# EAGLE design Adafruit PiCowbell Camera Breakout (EAGLE 9.6.2)
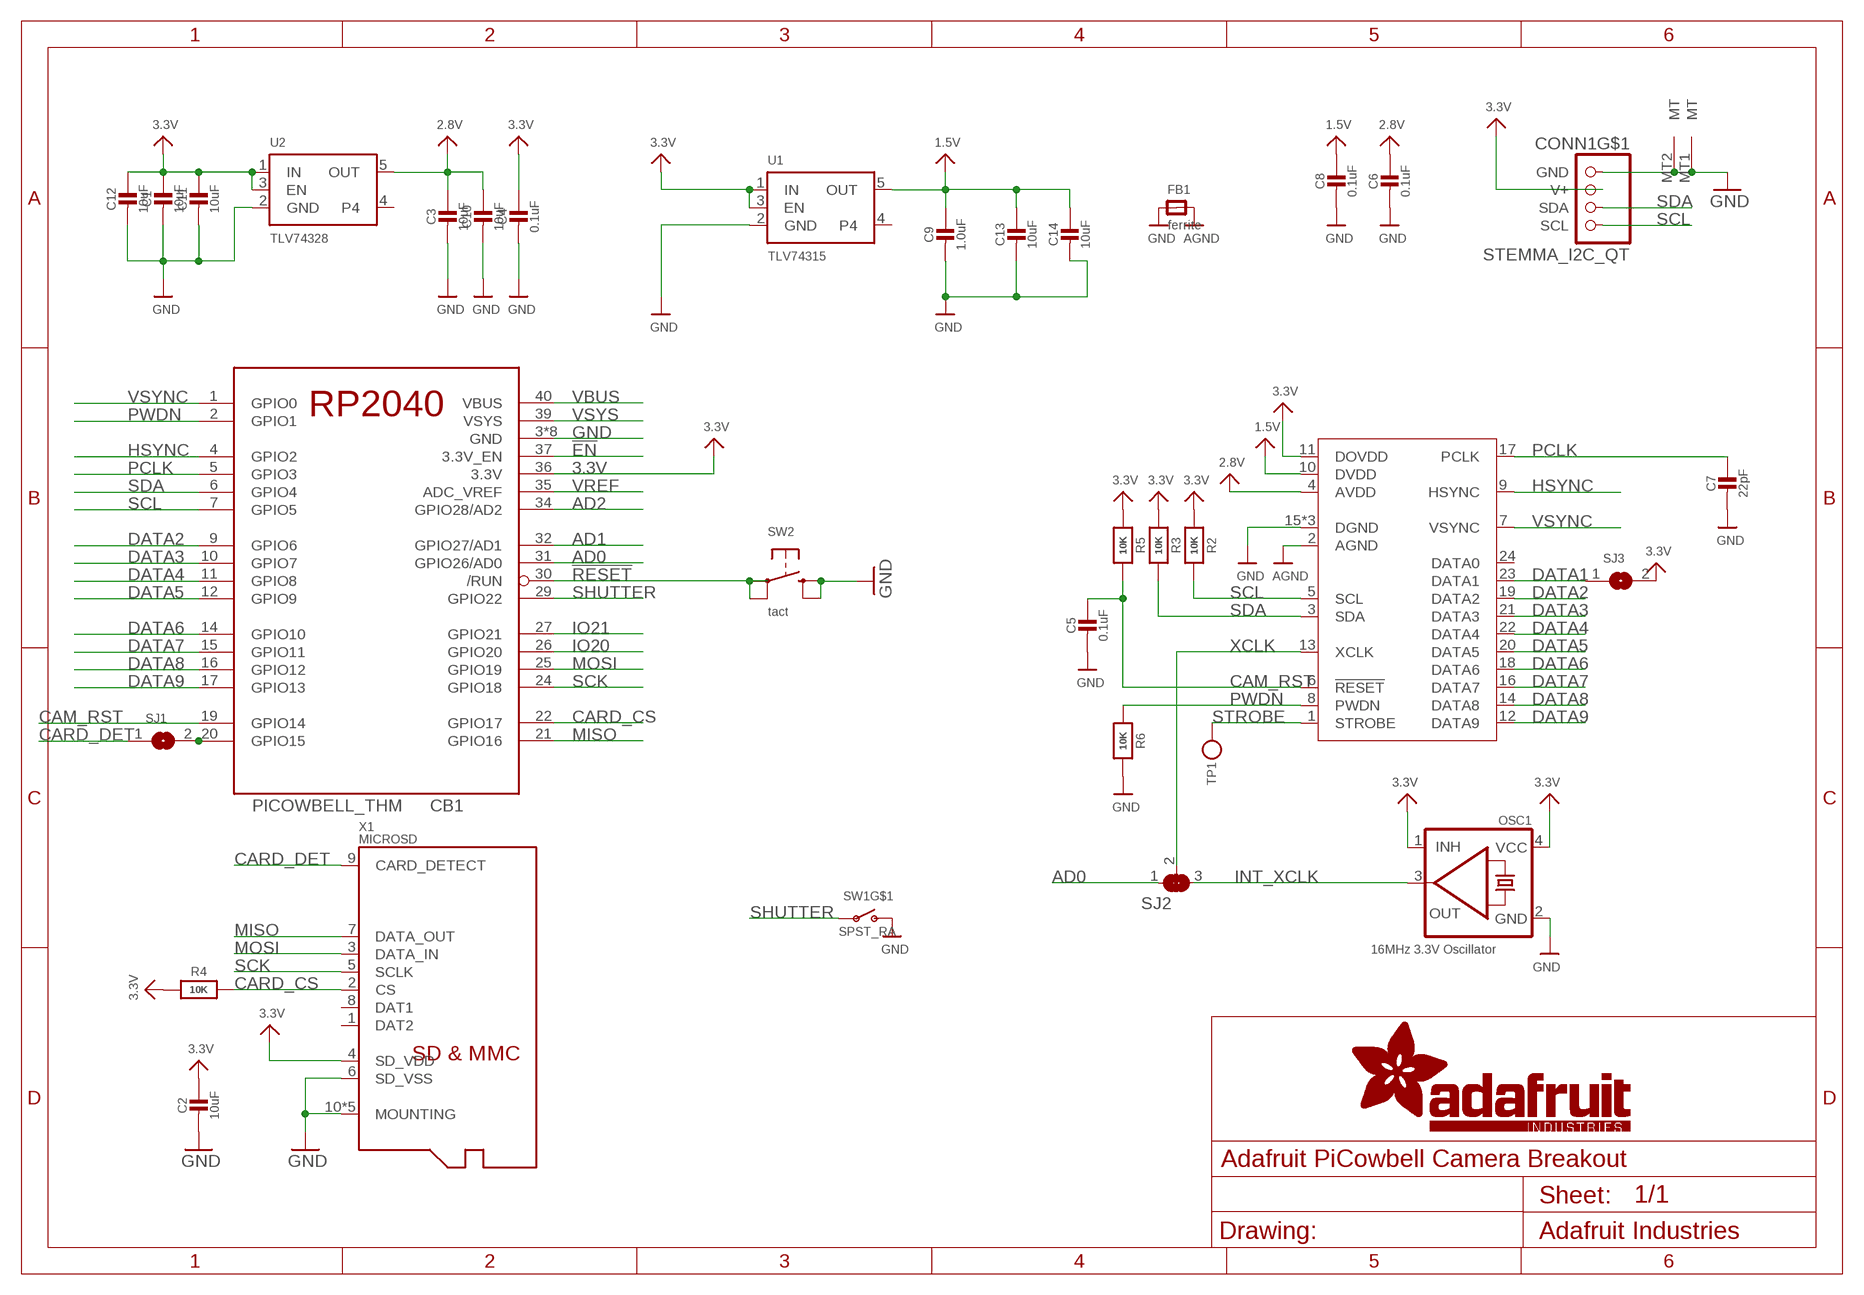
[diagram p0: schematic, sheet 1]

## Parts
C1  10uF  CAP_CERAMIC0805-NOOUTLINE  [0805-NO]
C2  10uF  CAP_CERAMIC0805-NOOUTLINE  [0805-NO]
C3  10uF  CAP_CERAMIC0805-NOOUTLINE  [0805-NO]
C4  0.1uF  CAP_CERAMIC_0402NO  [_0402NO]
C5  0.1uF  CAP_CERAMIC_0402NO  [_0402NO]
C6  0.1uF  CAP_CERAMIC_0402NO  [_0402NO]
C7  22pF  CAP_CERAMIC_0402NO  [_0402NO]
C8  0.1uF  CAP_CERAMIC_0402NO  [_0402NO]
C9  1.0uF  CAP_CERAMIC0603_NO  [0603-NO]
C10  10uF  CAP_CERAMIC0805-NOOUTLINE  [0805-NO]
C11  10uF  CAP_CERAMIC0805-NOOUTLINE  [0805-NO]
C12  10uF  CAP_CERAMIC0805-NOOUTLINE  [0805-NO]
C13  10uF  CAP_CERAMIC0805-NOOUTLINE  [0805-NO]
C14  10uF  CAP_CERAMIC0805-NOOUTLINE  [0805-NO]
CB1  PICOWBELL_THM  [PICOWBELL_THM]
CONN1  STEMMA_I2C_QT  [JST_SH4]
FB1  ferrite  FERRITE-0603NO  [0603-NO]
OSC1  16MHz 3.3V Oscillator  OSCILLATOR3.2X2.5  [OSC_3.2X2.5MM]
R2  10K  RESISTOR_0402NO  [_0402NO]
R3  10K  RESISTOR_0402NO  [_0402NO]
R4  10K  RESISTOR_0402NO  [_0402NO]
R5  10K  RESISTOR_0402NO  [_0402NO]
R6  10K  RESISTOR_0402NO  [_0402NO]
SJ1  SOLDERJUMPER  [SOLDERJUMPER_ARROW_NOPASTE]
SJ2  SOLDERJUMPER_2WAY  [SOLDERJUMPER_2WAY_OPEN_NOPASTE]
SJ3  SOLDERJUMPERCLOSED  [SOLDERJUMPER_CLOSEDWIRE]
SW1  SPST_RA  SWITCH_SPST_MNT_2*4*3.5  [SPST_TACTILE_RA_2*4*3.5MM]
SW2  tact  SWITCH_TACT_SMT_RKB2  [BTN_RKB2_4.6X2.8]
TP1  TESTPOINTROUND1.5MM  [TESTPOINT_ROUND_1.5MM]
U1  TLV74315  VREG_SOT23-5  [SOT23-5]
U2  TLV74328  VREG_SOT23-5  [SOT23-5]
X1  MICROSD  MICROSD104031-0811  [MOLEX_104031-0811]
X2  CAMERA_OV2640_SLIM  [OV2640FSL_SLIM]

## Nets
1.5V: C8.1 C9.1 C13.1 C14.1 U1.5(OUT) X2.10(DVDD)
2.8V: C3.1 C6.1 C10.1 U2.5(OUT) X2.4(AVDD)
3.3V: C1.1 C2.1 C4.1 C11.1 C12.1 CB1.36(3.3V) CONN1.2(V+) OSC1.1(INH) OSC1.4(VCC) R2.1 R3.1 R4.1 R5.1 SJ3.2 U1.1(IN) U1.3(EN) U2.1(IN) U2.3(EN) X1.4(SD_VDD) X2.11(DOVDD)
!EN: CB1.37(3.3V_EN)
!RESET: CB1.30(/RUN) SW2.A'(P1) SW2.A(P)
AD0: CB1.31(GPIO26/AD0) SJ2.1
AD1: CB1.32(GPIO27/AD1)
AD2: CB1.34(GPIO28/AD2)
AGND: FB1.2 X2.2(AGND)
CAM_RST: C5.1 CB1.19(GPIO14) R5.2 X2.6(!RESET)
CARD_CS: CB1.22(GPIO17) R4.2 X1.2(CS)
CARD_DET: SJ1.1 X1.9(CARD_DETECT)
DATA1: SJ3.1 X2.23(DATA1)
DATA2: CB1.9(GPIO6) X2.19(DATA2)
DATA3: CB1.10(GPIO7) X2.21(DATA3)
DATA4: CB1.11(GPIO8) X2.22(DATA4)
DATA5: CB1.12(GPIO9) X2.20(DATA5)
DATA6: CB1.14(GPIO10) X2.18(DATA6)
DATA7: CB1.15(GPIO11) X2.16(DATA7)
DATA8: CB1.16(GPIO12) X2.14(DATA8)
DATA9: CB1.17(GPIO13) X2.12(DATA9)
GND: C1.2 C2.2 C3.2 C4.2 C5.2 C6.2 C7.2 C8.2 C9.2 C10.2 C11.2 C12.2 C13.2 C14.2 CB1.3(GND) CB1.8(GND) CB1.13(GND) CB1.18(GND) CB1.23(GND) CB1.28(GND) CB1.33(GND) CB1.38(GND) CONN1.1(GND) CONN1.MT1(MT) CONN1.MT2(MT) FB1.1 OSC1.2(GND) R6.2 SW1.2(S) SW2.B'(S1) SW2.B(S) U1.2(GND) U2.2(GND) X1.6(SD_VSS) X1.10(MOUNTING) X1.G1(MOUNTING) X1.G2(MOUNTING) X1.G3(MOUNTING) X1.G4(MOUNTING) X2.15(DGND) X2.SPRT1(DGND) X2.SPRT2(DGND)
HSYNC: CB1.4(GPIO2) X2.9(HSYNC)
INT_XCLK: OSC1.3(OUT) SJ2.3
IO20: CB1.26(GPIO20)
IO21: CB1.27(GPIO21)
MISO: CB1.21(GPIO16) X1.7(DATA_OUT)
MOSI: CB1.25(GPIO19) X1.3(DATA_IN)
N$1: CB1.20(GPIO15) SJ1.2
PCLK: C7.1 CB1.5(GPIO3) X2.17(PCLK)
PWDN: CB1.2(GPIO1) R6.1 X2.8(PWDN)
SCK: CB1.24(GPIO18) X1.5(SCLK)
SCL: CB1.7(GPIO5) CONN1.4(SCL) R2.2 X2.5(SCL)
SDA: CB1.6(GPIO4) CONN1.3(SDA) R3.2 X2.3(SDA)
SHUTTER: CB1.29(GPIO22) SW1.1(P)
STROBE: TP1.P$1 X2.1(STROBE)
VBUS: CB1.40(VBUS)
VREF: CB1.35(ADC_VREF)
VSYNC: CB1.1(GPIO0) X2.7(VSYNC)
VSYS: CB1.39(VSYS)
XCLK: SJ2.2 X2.13(XCLK)
Unconnected: SW1.MT1(MT) SW1.MT2(MT) U1.4 U2.4 X1.1(DAT2) X1.8(DAT1) X2.24(DATA0)

## Library data of the parts
C1-C14 = microbuilder:CAP_CERAMIC: Ceramic Capacitors For new designs, use the packages preceded by an '_' character since they are more reliable: The following footprints should be used on most boards: _0402 - Standard footprint for regular board layouts _0603 - Standard footprint for regular board layouts _0805 - Standard footprint for regular board layouts _1206 - Standard footprint for regular board layouts For extremely tight-pitch boards where space is at a premium, the following 'micro-pitch' footprints can be used (smaller pads, no silkscreen outline, etc.): _0402MP - Micro-pitch footprint for very dense/compact boards _0603MP - Micro-pitch footprint for very dense/compact boards _0805MP - Micro-pitch footprint for very dense/compact boards _1206MP - Micro-pitch footprint for very dense/compact boards
CB1 = adafruit_micro:PICOWBELL
CONN1 = adafruit_electromech:STEMMA_I2C; LCSC: C2845363
FB1 = microbuilder:FERRITE: Ferrite Bead 0603 MMZ1608B121C - 120 Ohm @ 100MHz, 600mA, 0.15 Ohm DC Resistance - Digikey: 445-2164-1-ND BK1608HW121-T - 120 Ohm, 600mA Ferrite Chip - Digikey: 587-1876-2-ND 0805 HZ0805B272R-10 - 2.7K Ohm @ 100MHz, 200mA, 0.8 Ohm DC Resistance - Digikey: 240-2504-1-ND (see also Murata BLM21BD272SN1L) MMZ2012Y152B - 1.5K Ohm @ 100MHz, 500mA, 0.4 Ohm DC Resistance - Digikey: 445-1560-1-ND - Mainly for high frequency (80-400MHz) MMZ2012R102A - 1K Ohm @ 100MHz, 500mA, 0.3 Ohm DC Resistance - Digikey: 445-1555-2-ND - More general purpose (10-200MHz)
OSC1 = microbuilder:OSCILLATOR: Oscillators 3.2x2.5mm SMT 4.0MHz +/- 50ppm, 3.3V, 9mA, -40/+85°C - Digikey: 535-9752-1-ND 50MHz +/- 50ppm, 3.3V, 8mA, -10/+70°C - Digikey: 478-4792-1-ND 5x7mm SMT 4.0MHz +/-20ppm 3.3V, 20mA, -20/+70°C - Digikey: 535-9329-2-ND 50MHz +/- 25ppm 3.3V, 35mA, -40/+85°C - Digikey: 631-1197-1-ND
R2-R6 = microbuilder:RESISTOR: Resistors For new designs, use the packages preceded by an '_' character since they are more reliable: The following footprints should be used on most boards: _0402 - Standard footprint for regular board layouts _0603 - Standard footprint for regular board layouts _0805 - Standard footprint for regular board layouts _1206 - Standard footprint for regular board layouts For extremely tight-pitch boards where space is at a premium, the following 'micro-pitch' footprints can be used (smaller pads, no silkscreen outline, etc.): _0402MP - Micro-pitch footprint for very dense/compact boards _0603MP - Micro-pitch footprint for very dense/compact boards _0805MP - Micro-pitch footprint for very dense/compact boards _1206MP - Micro-pitch footprint for very dense/compact boards
SJ1 = microbuilder:SOLDERJUMPER: SMD Solder JUMPER Solder the two pads together to create a connection, or remove the solder to break it. REFLOW - Use this footprint for solder paste and reflow ovens. WAVE - Use this footprint for hand-soldering (larger pads). CLOSED - Has a trace between the two pads to ensure it is closed by default. The trace needs to be cut to disable the jumper, and can be closed again by creating a solder bridge between the two pads.; BOM: EXCLUDE
SJ2 = microbuilder:SOLDERJUMPER_2WAY: 2-Way Solder Jumper
SJ3 = microbuilder:SOLDERJUMPER: SMD Solder JUMPER Solder the two pads together to create a connection, or remove the solder to break it. REFLOW - Use this footprint for solder paste and reflow ovens. WAVE - Use this footprint for hand-soldering (larger pads). CLOSED - Has a trace between the two pads to ensure it is closed by default. The trace needs to be cut to disable the jumper, and can be closed again by creating a solder bridge between the two pads.
SW1 = adafruit_electromech:SWITCH_SPST_MNT: Switch - SPST 4UCon 19192 (6.7x2.6mm SMT)
SW2 = adafruit_electromech:SWITCH_TACT_SMT: SMT Tact Switches RKB2 https://www.digikey.com/short/m027prz5
TP1 = microbuilder:TESTPOINT: Test Point Various test points for characterisation and PCB testing TESTPOINT_SMT - Compact Surface Mount Test Point [Digikey: 5016KTR-ND]
U1 U2 = adafruit_power:VREG_SOT23-5: SOT23-5 Fixed Voltage Regulators Part Current Out V Out V In V Dropout θJA (°C/W) TJ (°C) Digikey Part No. ADP121 150mA 3.3V 3.4-5.5V 0.09V @ 150mA -- -- ADP121-AUJZ33R7CT-ND ADP121 150mA 3.0V 3.1-5.5V 0.09V @ 150mA -- -- ADP121-AUJZ30R7CT-ND ADP122 300mA 3.3V 3.4-5.5V 0.085V @ 300mA -- -- ADP122AUJZ-3.3-R7CT-ND ADP1712 300mA 3.3V 3.5-5.5V 0.17V @ 300mA -- -- ADP1712AUJZ-3.3-R7TR-ND AP7311 (Low Cost) 150mA 3.3V 3.5-6V 0.15V @ 150mA -- -- AP7311-33WG-7DICT-ND LD39015M18R 150mA 1.8V 1.9V-5.5V 0.08V @ 100mA -- -- 497-6977-1-ND LP2985A-33DBVR 150mA 3.3V 3.3-16V 0.28V @ 150mA 206 150 296-18479-1-ND MCP1824T-3302E/OT 300mA 3.3V 3.5V-6V 0.2V @ 300mA -- -- MCP1824T-3302E/OTCT-ND MIC5205-2.5YM5 TR 150mA 2.5V 2.7-16V 0.165V @ 150mA -- -- 576-1257-2-ND MIC5205-3.0YM5 TR 150mA 3.0V 3.2V-16V 0.165V @ 150mA -- -- 576-1258-2-ND MIC5205-3.3YM5 TR 150mA 3.3V 3.5V-16V 0.165V @ 150mA -- -- 576-1259-2-ND TPS780330220 150mA 3.3V+2.2V 3.6-5.5V 250mV Max -- -- 296-23332-1-ND TDA3663/N1,135 100mA 3.3V 3.5-45V 0.18V @ 50mA -- -- 568-5343-1-ND Max operating temp can be calculated using θJA, TJ (max junction temperature), and power in watts. Set the "Maximum Ambient Temperature" until it reaches TJ ("Max Junction Temperature"), which is the absolute limit for safe use of the regulator: Heat Sink Temperature Calculator <http://www.daycounter.com/Calculators/Heat-Sink-Temperature-Calculator.phtml> For example, With 12V source into a 3.3V LP2985 and a 30mA load, we are dissipating (12V-3.3V) * 0.03A = 0.261W. With a θJA of 206 °C/W, a TJ of 150°C, and 261mW we can safely use the chip without a heat sink up to 75°C (=147.1°C Junction Temperature).; JLC_ROTATION: 0
X1 = adafruit_electromech:MICROSD: MicroSD/Transflash Card Holder with SPI pinout 3M: 2908-05WB-MG 4UConnector: 19656 Footprint courtesy: Adafruit Industries
X2 = adafruit_sensor:CAMERA_OV2640

## Net classes
1 highpower: width 0.305 mm, drill 0.483 mm
2 lowpower: width 0.254 mm, drill 0.483 mm

## Board
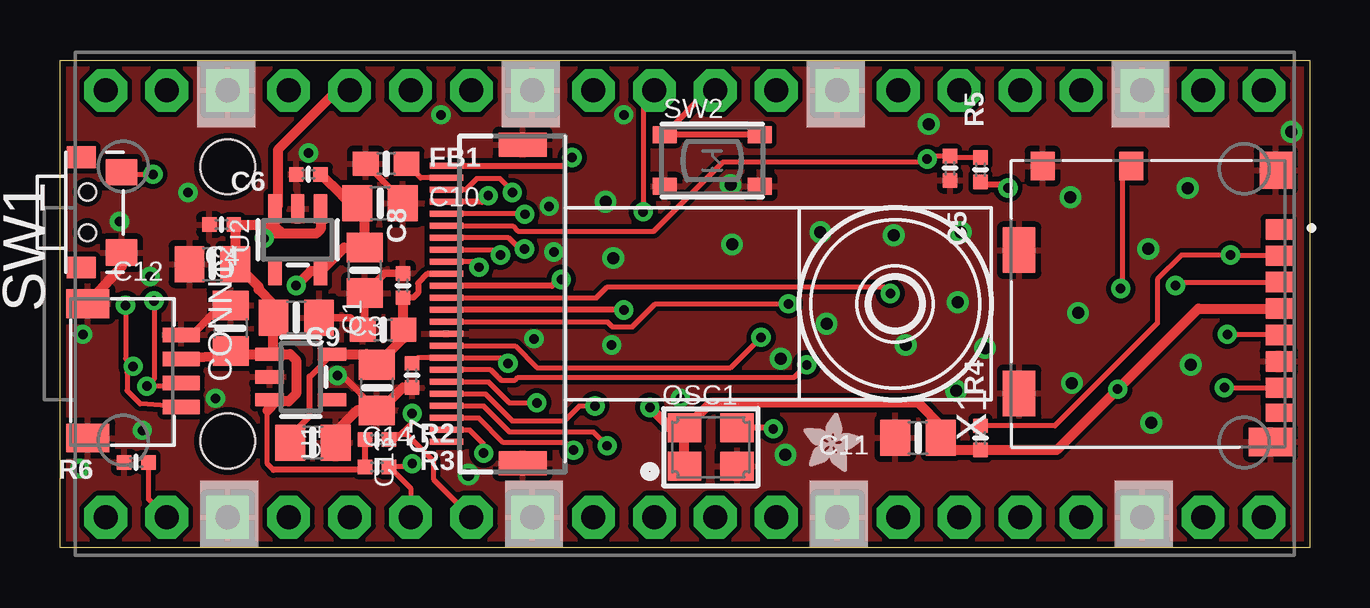
[diagram p1: board, top side]
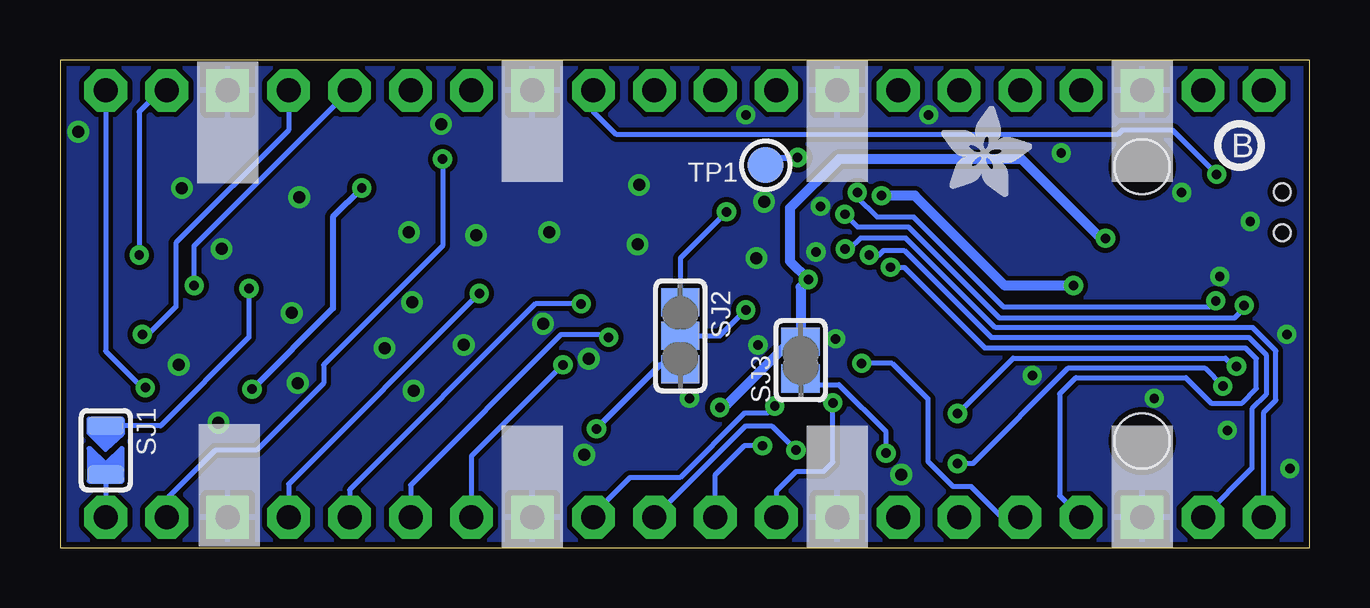
[diagram p2: board, bottom side, seen from below]

Size 52.07 x 20.32 mm. Coordinates in mm from the lower left corner, seen from the top.
Outline: 0,0 0,20.32 52.07,20.32 52.07,0 0,0
Copper layers (1*16): Top 0.035mm / dielectric 1.5mm / Bottom 0.035mm
Design rules "adafruit": minimum track width 8mil, minimum drill 15.5mil, track to track 8mil, track to pad 8mil, pad to pad 8mil, via to via 8mil, smd to smd 8mil, copper to edge 10mil, drill to drill 8mil, minimum pad ring 10mil, minimum via ring 8mil, stop-mask expansion 2mil, vias tented up to drill 20mil, thermal gap 10mil
Holes 2.29 mm at 6.99,15.88 6.99,4.45

### Footprints (pad centres in the part's own frame; a part is rotated, then mirrored left to right if it is on the bottom)
0805-NO = smd 1.24 x 1.5: 1 -0.95,0; 2 0.95,0
_0402NO = smd 0.6 x 0.6: 1 -0.508,0; 2 0.508,0
0603-NO = smd 1.075 x 1: 1 -0.85,0; 2 0.85,0
PICOWBELL_THM = drill 1 pad 1.778 octagon: 1 1.27,0; 2 3.81,0; 4 8.89,0; 5 11.43,0; 6 13.97,0; 7 16.51,0; 9 21.59,0; 10 24.13,0; 11 26.67,0; 12 29.21,0; 14 34.29,0; 15 36.83,0; 16 39.37,0; 17 41.91,0; 19 46.99,0; 20 49.53,0; 21 49.53,17.78; 22 46.99,17.78; 24 41.91,17.78; 25 39.37,17.78; 26 36.83,17.78; 27 34.29,17.78; 29 29.21,17.78; 30 26.67,17.78; 31 24.13,17.78; 32 21.59,17.78; 34 16.51,17.78; 35 13.97,17.78; 36 11.43,17.78; 37 8.89,17.78; 39 3.81,17.78; 40 1.27,17.78 | drill 1 pad 1.778 square: 3 6.35,0; 8 19.05,0; 13 31.75,0; 18 44.45,0; 23 44.45,17.78; 28 31.75,17.78; 33 19.05,17.78; 38 6.35,17.78
JST_SH4 = smd 0.6 x 1.55: 1 -1.5,2.006; 2 -0.5,2.006; 3 0.5,2.006; 4 1.5,2.006 | smd 1.2 x 1.8: MT1 -2.8,-1.894; MT2 2.8,-1.894
OSC_3.2X2.5MM = smd 1.4 x 1.2: 1 -1.1,-0.8; 2 1.1,-0.8; 3 1.1,0.8; 4 -1.1,0.8
SOLDERJUMPER_ARROW_NOPASTE = smd 0.762 x 1.524: 1 -1.016,0; 2 1.016,0
SOLDERJUMPER_2WAY_OPEN_NOPASTE = smd 1.168 x 1.6: 1 -1.397,0; 2 0,0; 3 1.397,0
SOLDERJUMPER_CLOSEDWIRE = smd 1.168 x 1.6: 1 -0.762,0; 2 0.762,0 | smd 0.635 x 0.203: WIRE 0,0
SPST_TACTILE_RA_2*4*3.5MM = smd 1.1 x 1.3: 1 -1.675,1.042; 2 1.675,1.042 | smd 0.9 x 1.2: MT1 -2.3,-0.635; MT2 2.3,-0.635 | hole 0.7: -0.85,-0.381; 0.85,-0.381
BTN_RKB2_4.6X2.8 = smd 1 x 0.7: A 1.973,1.075; A' -1.973,1.075; B 1.973,-1.075; B' -1.973,-1.075
TESTPOINT_ROUND_1.5MM = smd 1.5 x 1.5: P$1 0,0
SOT23-5 = smd 0.55 x 1.2: 1 -0.95,-1.3; 2 0,-1.3; 3 0.95,-1.3; 4 0.95,1.3; 5 -0.95,1.3
MOLEX_104031-0811 = smd 0.85 x 1.1: 1 3.105,-5.45; 2 2.005,-5.45; 3 0.905,-5.45; 4 -0.195,-5.45; 5 -1.295,-5.45; 6 -2.395,-5.45; 7 -3.495,-5.45 | smd 0.75 x 1.1: 8 -4.545,-5.45 | smd 1.2 x 1: 9 5.74,0.7; 10 5.74,4.4 | smd 1.55 x 1.35: G1 5.565,-5.325 | smd 1.17 x 1.8: G2 -5.755,-5.1 | smd 1.9 x 1.35: G3 -3.73,5.375; G4 2.24,5.375
OV2640FSL_SLIM = smd 0.25 x 1.4: 1 5.75,1.678; 2 5.25,1.678; 3 4.75,1.678; 4 4.25,1.678; 5 3.75,1.678; 6 3.25,1.678; 7 2.75,1.678; 8 2.25,1.678; 9 1.75,1.678; 10 1.25,1.678; 11 0.75,1.678; 12 0.25,1.678; 13 -0.25,1.678; 14 -0.75,1.678; 15 -1.25,1.678; 16 -1.75,1.678; 17 -2.25,1.678; 18 -2.75,1.678; 19 -3.25,1.678; 20 -3.75,1.678; 21 -4.25,1.678; 22 -4.75,1.678; 23 -5.25,1.678; 24 -5.75,1.678 | smd 1 x 2: SPRT1 -6.635,-1.5; SPRT2 6.635,-1.5

### Placement (x,y rotation side)
C1  9.84,9.59 0 top
C2  7.11,9.14 90 top
C3  12.7,11.56 270 top
C4  6.73,13.46 180 top
C5  37.08,15.81 270 top
C6  10.35,15.56 180 top
C7  14.67,7.18 270 top
C8  14.29,10.92 90 top
C9  13.46,9.08 180 top
C10  13.34,14.35 0 top
C11  35.75,4.57 180 top
C12  6.35,11.81 180 top
C13  13.21,6.67 270 top
C14  10.54,4.38 0 top
CB1  0.64,1.27 0 top
CONN1  3.05,7.37 270 top
FB1  13.59,16 0 top
OSC1  27.11,4.19 0 top
PLABEL54  [PLABEL54]  50.29,7.37 0 bottom
PLABEL55  [PLABEL55]  3.49,13.91 90 top
PLABEL56  [PLABEL56]  1.78,2.92 0 top
PLABEL57  [PLABEL57]  4.57,2.92 0 top
PLABEL58  [PLABEL58]  9.53,2.92 0 top
PLABEL59  [PLABEL59]  11.81,2.92 0 top
PLABEL60  [PLABEL60]  14.61,2.92 0 top
PLABEL61  [PLABEL61]  22.23,2.92 0 top
PLABEL62  [PLABEL62]  29.84,2.92 0 top
PLABEL63  [PLABEL63]  34.92,2.92 0 top
PLABEL64  [PLABEL64]  37.47,2.92 0 top
PLABEL65  [PLABEL65]  40.01,2.92 0 top
PLABEL66  [PLABEL66]  42.55,2.92 0 top
PLABEL67  [PLABEL67]  47.62,2.92 0 top
PLABEL68  [PLABEL68]  50.16,2.92 0 top
PLABEL69  [PLABEL69]  50.16,17.4 0 top
PLABEL70  [PLABEL70]  47.62,17.4 0 top
PLABEL71  [PLABEL71]  42.55,17.4 0 top
PLABEL72  [PLABEL72]  40.01,17.4 0 top
PLABEL73  [PLABEL73]  37.47,17.4 0 top
PLABEL74  [PLABEL74]  34.92,17.4 0 top
PLABEL75  [PLABEL75]  30.35,17.14 90 top
PLABEL76  [PLABEL76]  24,17.14 90 top
PLABEL77  [PLABEL77]  22.23,17.4 0 top
PLABEL78  [PLABEL78]  14.61,17.4 0 top
PLABEL79  [PLABEL79]  12.06,17.4 0 top
PLABEL80  [PLABEL80]  9.53,17.4 0 top
PLABEL81  [PLABEL81]  4.45,17.4 0 top
PLABEL82  [PLABEL82]  1.91,17.4 0 top
PLABEL83  [PLABEL83]  16.13,2.92 0 top
PLABEL84  [PLABEL84]  31.62,15.24 0 top
PLABEL85  [PLABEL85]  13.34,12.06 0 bottom
PLABEL86  [PLABEL86]  38.23,9.65 0 bottom
PLABEL88  [PLABEL88]  42.55,2.41 90 bottom
PLABEL89  [PLABEL89]  40.01,2.41 90 bottom
PLABEL90  [PLABEL90]  37.47,2.41 90 bottom
PLABEL91  [PLABEL91]  34.92,2.41 90 bottom
PLABEL92  [PLABEL92]  29.84,2.41 90 bottom
PLABEL93  [PLABEL93]  27.3,2.41 90 bottom
PLABEL94  [PLABEL94]  24.77,2.41 90 bottom
PLABEL95  [PLABEL95]  22.23,2.41 90 bottom
PLABEL96  [PLABEL96]  17.14,2.41 90 bottom
PLABEL97  [PLABEL97]  14.61,2.41 90 bottom
PLABEL98  [PLABEL98]  12.06,2.41 90 bottom
PLABEL99  [PLABEL99]  9.53,2.41 90 bottom
PLABEL100  [PLABEL100]  4.45,2.41 90 bottom
PLABEL101  [PLABEL101]  1.91,2.41 90 bottom
PLABEL102  [PLABEL102]  50.16,17.91 90 bottom
PLABEL103  [PLABEL103]  47.62,2.41 90 bottom
PLABEL104  [PLABEL104]  42.55,17.91 90 bottom
PLABEL107  [PLABEL107]  24.51,6.6 90 bottom
PLABEL108  [PLABEL108]  27.43,5.84 0 bottom
PLABEL109  [PLABEL109]  27.05,11.81 0 bottom
PLABEL110  [PLABEL110]  20.07,7.24 0 bottom
PLABEL111  [PLABEL111]  40.01,16.89 90 bottom
PLABEL112  [PLABEL112]  47.62,17.02 90 bottom
PLABEL113  [PLABEL113]  29.84,16.51 90 bottom
R2  13.21,4.51 0 top
R3  13.21,3.37 0 top
R4  38.35,4.57 90 top
R5  38.35,15.75 90 top
R6  3.17,3.56 180 top
SJ1  50.16,4.06 270 bottom
SJ2  26.23,8.83 270 bottom
SJ3  21.21,7.81 90 bottom
SW1  1.52,13.97 270 top
SW2  27.18,16.13 0 top
TP1  22.67,15.94 180 bottom
U1  10.03,7.11 270 top
U2  9.91,12.83 180 top
U$10  [ADAFRUIT_3.5MM]  15.37,14.61 0 bottom
U$11  [ADAFRUIT_2.5MM]  30.99,3.17 0 top
U$12  [PCBFEAT-REV-040]  2.92,16.76 0 bottom
X1  45.34,10.16 90 top
X2  17.78,10.16 90 top

### Tracks (layer width: path | path; a pad name or v marks a point on that pad's centre or on a via)
1.5V
  Top 0.254: X2.10 15.31,11.41 14.92,11.02 14.92,10.61 14.72,10.41 C8.1 | C14.1 9.59,4.66 10.4,5.47 10.4,7.13 U1.5
  Top 0.406: U1.5 12.76,8.06 C13.1 14.31,8.72 C9.1 14.31,10.39 C8.1
2.8V  (via drill 0.39)
  Top 0.254: v17.84,14.67 17.59,14.41 X2.4
  Top 0.406: v9.84,10.92 10.45,11.53 U2.5 11.84,12.51 C3.1 12.7,14.04 C10.1 12.38,14.29 12.14,14.29 11.3,15.13 11.28,15.13 C6.1
  Bottom 0.406: v9.84,10.92 12.7,10.92 16.45,14.67 v17.84,14.67
3.3V  (via drill 0.39)
  Top 0.203: 8.89,3.24 8.64,3.5 8.64,5.71 | C2.1 7.11,8.12 6.99,7.99
  Top 0.254: R2.1 R3.1 12.57,3.24 8.89,3.24 | v20.89,11.18 20.77,11.18 20.5,10.91 X2.11 | R5.1 38.48,15.11 39.37,15.11 v39.5,14.99
  Top 0.406: X1.4 47.43,9.96 v44.07,6.6 41.53,4.06 R4.1 37.21,4.06 C11.1 36.7,5.08 35.75,6.03 27.11,6.03 26.29,5.21 25.21,5.21 v24.57,5.84 25.43,4.99 OSC1.4 OSC1.1 | C2.1 7.45,8.06 U1.1 | U1.1 8.89,8.22 C1.1 8.89,10.14 8.28,10.76 8.28,10.88 7.34,11.81 C12.1 7.3,13.44 C4.1 8.68,13.46 8.96,13.74 U2.3 | U1.1 9.59,8.06 9.84,7.81 9.84,6.41 9.53,6.1 9.02,6.1 | 9.02,6.1 8.64,5.71 | 9.02,6.1 8.8,6.1 U1.3 | 6.99,7.99 CONN1.2 | U2.1 10.86,13.27 10.67,13.08 9.27,13.08 | 9.27,13.08 8.51,13.08 v8.51,12.89 | 9.27,13.08 8.96,13.4 U2.3 | U2.3 9.08,14.25 9.08,16.57 11.56,19.05 CB1.36
  Bottom 0.254: v39.5,14.99 40.7,13.78 40.7,9.97 v44.07,6.6
  Bottom 0.406: v8.51,12.89 8.7,12.89 12,16.19 19.61,16.19 21.65,14.14 21.65,11.94 v20.89,11.18 21.21,10.86 SJ3.2 21.65,8.57 24.38,5.84 v24.57,5.84
!RESET
  Top 0.254: SW2.A SW2.A' 26.99,19.05 CB1.30
AD0  (via drill 0.39)
  Top 0.203: CB1.31 24.3,18.58 v24.3,13.99
  Bottom 0.203: v24.3,13.99 26.23,12.06 SJ2.1
AGND
  Top 0.203: X2.2 15.03,15.41 FB1.2
CAM_RST  (via drill 0.39)
  Top 0.203: X2.6 18.85,13.41 19.08,13.19 24.75,13.19 27.62,16.07 36.01,16.07 v36.13,16.19 36.24,16.3 C5.1 37.15,16.26 R5.2
  Bottom 0.203: CB1.19 47.62,2.03 45.59,4.06 43.88,4.06 41.08,6.86 41.08,7.62 36.13,12.57 v36.13,16.19
CARD_CS  (via drill 0.39)
  Top 0.203: X1.2 50.76,12.19 v48.77,12.19 46.74,12.19 45.72,11.18 45.72,9.34 41.46,5.08 R4.2
  Bottom 0.203: CB1.22 47.88,19.05 48.77,18.16 v48.77,12.19
CARD_DET  (via drill 0.39)
  Top 0.203: X1.9 44.26,15.52 44.26,10.86 v44.2,10.79
  Bottom 0.203: v44.2,10.79 44.2,8.76 47.88,5.08 SJ1.1
DATA1  (via drill 0.39)
  Top 0.203: X2.23 17.06,4.91 17.65,4.32 v17.65,3.94
  Bottom 0.203: v17.65,3.94 17.65,4.83 19.62,6.79 20.95,6.79 SJ3.1
DATA2  (via drill 0.39)
  Top 0.203: X2.19 17.85,6.91 18.73,6.04 v19.87,6.04
  Bottom 0.203: CB1.9 22.23,2.35 21.4,3.17 20.26,3.17 19.87,3.56 v19.87,6.04
DATA3  (via drill 0.39)
  Top 0.203: X2.21 17.64,5.91 18.73,4.82 22.23,4.82 v22.8,4.25
  Bottom 0.203: CB1.10 24.77,3.04 23.56,4.25 v22.8,4.25
DATA4  (via drill 0.39)
  Top 0.203: X2.22 17.45,5.41 18.48,4.38 21.08,4.38 v21.4,4.06
  Bottom 0.203: v21.4,4.06 22.42,5.08 23.5,5.08 CB1.11
DATA5  (via drill 0.39)
  Top 0.203: X2.20 17.72,6.41 18.86,5.27 21.02,5.27 21.65,5.91 v22.29,5.91
  Bottom 0.203: v22.29,5.91 22.58,5.61 23.54,5.61 26.23,2.92 28.32,2.92 29.84,1.4 CB1.12
DATA6  (via drill 0.39)
  Top 0.203: v31.11,7.62 30.59,7.09 19.07,7.09 18.96,6.98 18.38,6.98 18.23,7.12 17.94,7.41 X2.18
  Bottom 0.203: v31.11,7.62 34.92,3.81 CB1.14
DATA7  (via drill 0.39)
  Top 0.203: X2.16 18.96,8.41 19.87,7.5 27.95,7.5 v29.21,8.76
  Bottom 0.203: v29.21,8.76 29.34,8.89 31.18,8.89 37.47,2.6 CB1.15
DATA8  (via drill 0.39)
  Top 0.203: X2.14 22.8,9.41 23.01,9.2 23.85,9.2 24.81,10.16 v30.35,10.16
  Bottom 0.203: v30.35,10.16 32.26,10.16 40.01,2.41 CB1.16
DATA9  (via drill 0.39)
  Top 0.203: X2.12 22.35,10.41 22.8,10.87 34.33,10.87 v34.6,10.59
  Bottom 0.203: v34.6,10.59 42.55,2.65 CB1.17
GND  (via drill 0.39, 0.5)
  Top 0.203: C13.2
  Top 0.254: v11.56,7.18 11.75,7.18 C13.2 | C10.2 14.29,14.46 FB1.1
  Top 0.305: C8.2 13.52,11.43 C3.2 12.7,9.17 C9.2 12.1,9.59 C1.2 | C2.2 6.73,10.09 5.63,8.99 CONN1.1
  Top 0.406: SW1.2 2.57,11.71 CONN1.MT1 | C7.2 14.29,6.67 13.34,5.72 C13.2 12.38,5.72 11.49,4.83 C14.2
  other vias: 42.42,9.78 42.16,6.86 45.47,5.21 47.12,7.62 46.99,14.99 45.34,12.45 3.43,4.89 0.95,8.89 0.83,3.3 2.48,13.59 3.75,11.3 6.48,6.22 19.75,8.7 22.99,8.45 20.57,12.32 20.38,14.22 15.88,18.03 31.69,13.14 37.53,13.14 34.73,13.02 37.4,10.22 38.54,8.32 37.34,6.54 35.24,8.45 31.94,9.33 30.04,7.87 30.23,3.87 23.5,18.03 10.35,16.45 42.1,14.61 51.31,17.34 27.94,15.11 22.73,14.41 25.84,6.22 36.2,17.65 23.05,12.06 28,12.64 5.33,14.8 17.02,3.05
  pour Top: 0,20.32 0,0 52.01,0 52.01,20.32
  pour Bottom: 0,20.32 0,0 52.07,0 52.07,20.32
HSYNC  (via drill 0.39)
  Top 0.203: v17.46,11.68 17.24,11.91 X2.9
  Bottom 0.203: CB1.4 10.41,2.16 10.41,6.41 9.74,7.09 5.16,7.09 4.1,6.03 2.82,6.03 2.22,6.62 2.22,7.87 2.67,8.32 13.53,8.32 16.89,11.68 v17.46,11.68
INT_XCLK  (via drill 0.39)
  Top 0.254: v29.72,4.95 29.68,4.99 OSC1.3
  Bottom 0.254: v29.72,4.95 27.05,7.62 SJ2.3
MISO  (via drill 0.39)
  Top 0.203: v48.51,6.67 X1.7
  Bottom 0.203: CB1.21 50.16,8.19 48.64,6.67 v48.51,6.67
MOSI  (via drill 0.39)
  Top 0.203: v46.48,10.92 46.62,11.06 X1.3
  Bottom 0.203: v46.48,10.92 46.48,12.57 CB1.25
N$1
  Bottom 0.203: SJ1.2 CB1.20
N$2
  Bottom 0.203: 26.23,8.32 26.23,8
PCLK  (via drill 0.39)
  Top 0.203: C7.1 14.89,7.91 X2.17 18.44,7.91 v18.67,7.68
  Bottom 0.203: CB1.5 12.83,1.27 14.1,2.54 14.86,2.54 15.9,3.58 15.9,6.19 17.4,7.68 v18.67,7.68
PWDN  (via drill 0.39)
  Top 0.203: X2.8 18.13,12.41 v18.35,12.19 | CB1.2 3.68,2.03 R6.1
  Bottom 0.203: v18.35,12.19 17.95,12.19 17.75,12.39 16.89,12.39 13.27,8.76 2.54,8.76 1.82,8.04 1.82,6.38 2.41,5.78 2.41,3.3 CB1.2
SCK  (via drill 0.39)
  Top 0.203: v48.64,8.89 50.76,8.89 X1.5
  Bottom 0.203: CB1.24 42.55,17.4 47.24,12.7 47.24,10.03 48.39,8.89 v48.64,8.89
SCL  (via drill 0.39)
  Top 0.203: CB1.7 15.56,2.86 15.56,3.62 14.48,4.7 13.91,4.7 R2.2 13.97,4.51 14.67,5.21 v14.67,5.59 | CONN1.4 3.34,5.99 2.79,6.54 2.79,7.3 v3.05,7.56 2.73,7.87 v2.73,10.1 | v19.37,13.89 19.35,13.91 X2.5
  Bottom 0.203: v3.05,7.56 3.17,7.56 3.52,7.9 12.36,7.9 v14.67,5.59 | v19.37,13.89 18.84,13.37 16.72,13.37 12.93,9.58 3.12,9.58 2.67,10.03 v2.73,10.1
SDA  (via drill 0.39)
  Top 0.203: CB1.6 14.61,2.48 R3.2 14.54,3.37 v14.68,3.5 | CONN1.3 4.79,6.73 v3.62,6.73 3.94,7.05 3.94,10.26 v3.92,10.29 | v18.85,14.79 18.88,14.82 18.33,15.37 17.36,15.37 16.9,14.91 X2.3
  Bottom 0.203: v14.68,3.5 14.04,3.5 10.05,7.49 4.38,7.49 v3.62,6.73 | v3.92,10.29 4.17,10.03 12.76,10.03 16.52,13.79 18.03,13.79 18.85,14.61 v18.85,14.79
SHUTTER  (via drill 0.39)
  Top 0.203: SW1.1 2.65,15.56 v3.87,15.56
  Bottom 0.203: v3.87,15.56 5.71,17.4 7.81,17.4 8,17.21 28.89,17.21 29.84,18.16 CB1.29
STROBE  (via drill 0.39)
  Top 0.254: v21.34,16.26 20.99,15.91 X2.1
  Bottom 0.254: TP1.P$1 22.35,16.26 v21.34,16.26
VSYNC  (via drill 0.39)
  Top 0.203: X2.7 18.69,12.91 19.16,12.45 v19.36,12.45
  Bottom 0.203: CB1.1 1.91,5.65 1.4,6.15 1.4,8.2 2.37,9.17 13.1,9.17 16.83,12.9 18.71,12.9 19.16,12.45 v19.36,12.45
XCLK  (via drill 0.39)
  Top 0.254: v23.5,9.91 X2.13
  Bottom 0.203: SJ2.2 24.57,8.83 v23.5,9.91

### Text on the board
Pinguin_tBackup: VB | VS | 3V | Vr | A2 | A0 | R | 22 | 20 | 19 | 18 | 17 | 16 | VB | VS | EN | 3V | Vr | A1 | A0 | 22 | 21 | 20 | 19 | MO | 18 | SCK | G | 17 | CS | 16 | MI | I2C | G | EN | 3V | VR | A1 | Reset | 20 | VB | 22 | VS | 3 | I2C QT | RST | RESET | D | C | QT | 0 | 1 | 2 | 3 | SDA | SCL | 6 | 11 | 0 | 1 | 2 | 3 | 4 | 5 | 6 | 7 | 8 | 9 | 11 | 12 | 13 | 14 | 15 | 0 | 1 | 2 | 3 | 4 | 5 | 6 | 9 | 10 | 11 | 12 | 12 | 13 | 13 | G | 14 | 14 | 15 | 15
Pinguin_bBackup: VB | VS | 3V | Vr | A2 | A0 | R | 22 | 20 | 19 | 18 | 17 | 16 | SHTR | MOSI | SCK | SDCS | MISO | MO | CS | BTN | VB | EN | 3V | VR | A2 | A1 | A0 | RST | 22 | 21 | 20 | VS | QT & PCF8523 on I2C 4+5 | Camera PiCowbell / DVP Camera+SD | A0 | SPI 16, 18, 19, CS:17 | Data:IO6~13,PCLK: 3, / RST: 14,VS: 0,HS: 2, / SHDN: 1,SDA: 4,SCL: 5 / SPI: 16,18,19 SDCS: 17 / Shutter:22 | Vmotor | SD / Det | XCLK | INT | 0 | 1 | 2 | 3 | SDA | SCL | 6 | 7 | 8 | 9 | 10 | 11 | 0 | 1 | 2 | 3 | 4 | 5 | 6 | 7 | 8 | 9 | 11 | 12 | 13 | 14 | 15 | VSYNC | PWDN | HSYNC | PCLK | SDA | SCL | D2 | D3 | D4 | D5 | D6 | D7 | D8 | D9 | RST